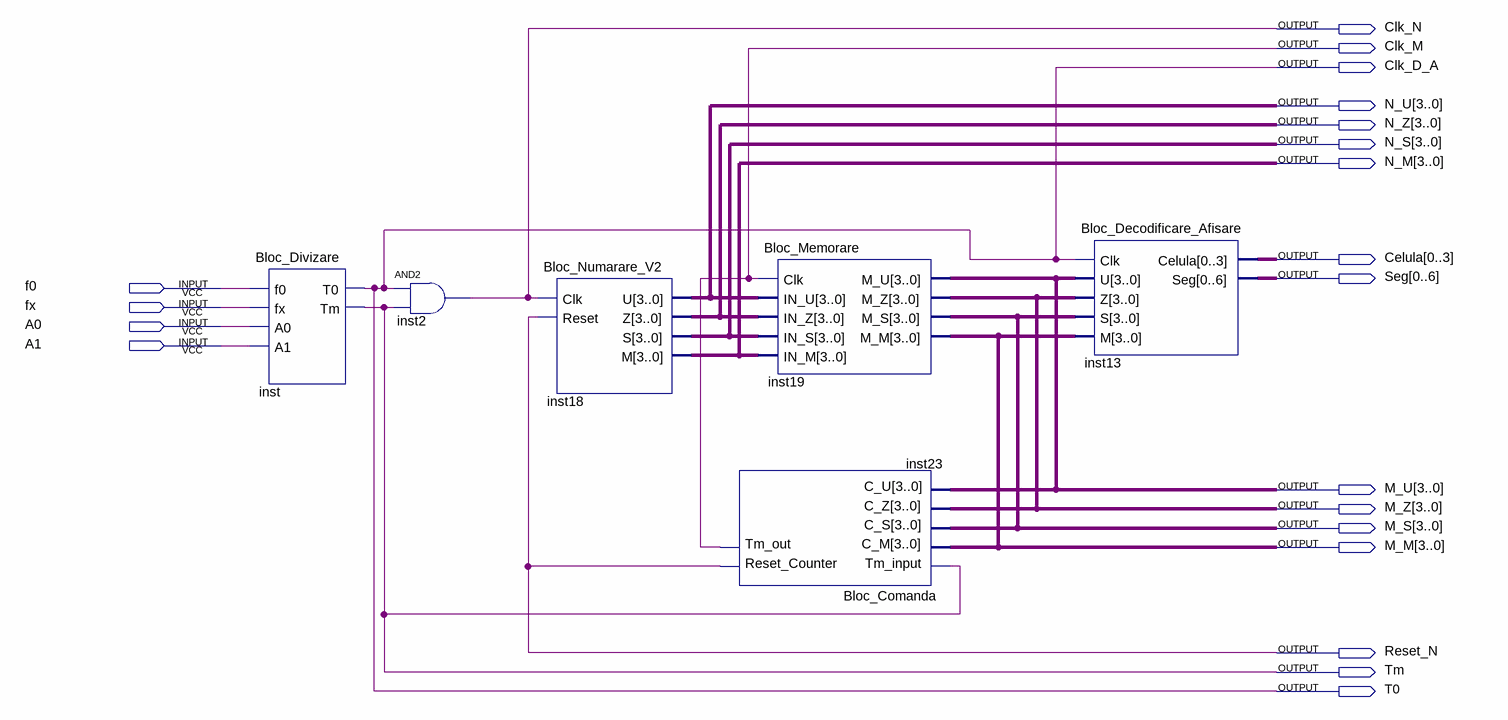
[diagram p0: schematic sheet]
// Quartus schematic Periodmetru.bdf as structural Verilog: 6 symbols, 20 pins
module Periodmetru (
  input  f0,
  input  fx,
  input  A0,
  input  A1,
  output Clk_N,
  output Clk_M,
  output Clk_D_A,
  output [3:0] N_U,
  output [3:0] N_Z,
  output [3:0] N_S,
  output [3:0] N_M,
  output [0:3] Celula,
  output [0:6] Seg,
  output [3:0] M_U,
  output [3:0] M_Z,
  output [3:0] M_S,
  output [3:0] M_M,
  output Reset_N,
  output Tm,
  output T0
);

  Bloc_Divizare inst (.f0(f0), .fx(fx), .A0(A0), .A1(A1), .T0(Clk_D_A), .Tm(Tm));
  and inst2 (Clk_N, Clk_D_A, Tm);
  Bloc_Numarare_V2 inst18 (.Clk(Clk_N), .Reset(Reset_N), .U(N_U), .Z(N_Z), .S(N_S), .M(N_M));
  Bloc_Comanda inst23 (
    .Tm_input(Tm), .C_M(M_M), .C_S(M_S), .C_Z(M_Z), .C_U(M_U), .Reset_Counter(Reset_N), .Tm_out(Clk_M));
  Bloc_Memorare inst19 (
    .Clk(Clk_M), .IN_U(N_U), .IN_Z(N_Z), .IN_S(N_S), .IN_M(N_M), .M_U(M_U), .M_Z(M_Z), .M_S(M_S), .M_M(M_M));
  Bloc_Decodificare_Afisare inst13 (.Clk(Clk_D_A), .U(M_U), .Z(M_Z), .S(M_S), .M(M_M), .Celula(Celula), .Seg(Seg));

  assign T0 = Clk_D_A;
endmodule
